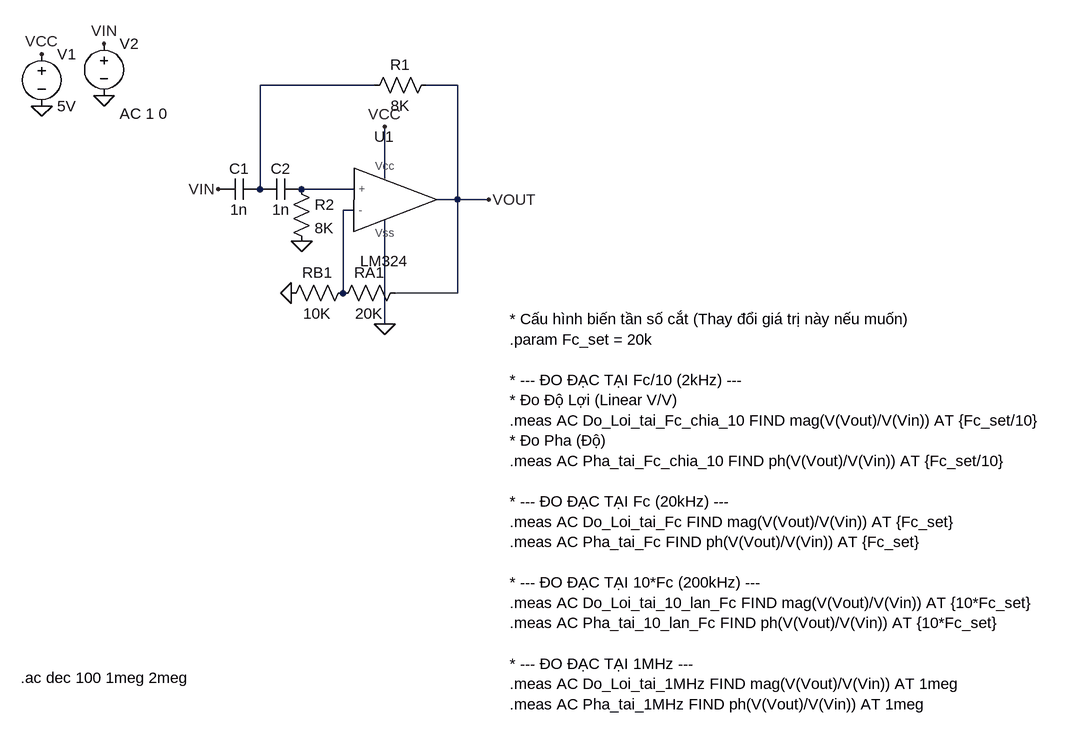
[diagram p0: schematic BAI 4 THUC HANH 3.asc]
BAI 4 THUC HANH 3.asc, the LTspice schematic file:
Version 4.1
SHEET 1 1424 1044
WIRE 320 -32 144 -32
WIRE 448 -32 400 -32
WIRE 336 112 336 32
WIRE 144 128 144 -32
WIRE 288 128 208 128
WIRE 448 144 448 -32
WIRE 448 144 416 144
WIRE 496 144 448 144
WIRE 288 160 272 160
WIRE 272 288 272 160
WIRE 448 288 448 144
WIRE 448 288 352 288
WIRE 336 336 336 176
FLAG 496 144 VOUT
FLAG 208 208 0
FLAG 192 288 0
FLAG 80 128 VIN
FLAG 336 32 VCC
FLAG -96 -16 0
FLAG -192 0 0
FLAG -192 -80 VCC
FLAG -96 -96 VIN
FLAG 336 336 0
SYMBOL LM324 336 144 R0
SYMATTR InstName U1
SYMBOL res 416 -48 R90
WINDOW 0 0 56 VBottom 2
WINDOW 3 32 56 VTop 2
SYMATTR InstName R1
SYMATTR Value 8K
SYMBOL cap 144 112 R90
WINDOW 0 0 32 VBottom 2
WINDOW 3 32 32 VTop 2
SYMATTR InstName C1
SYMATTR Value 1n
SYMBOL cap 208 112 R90
WINDOW 0 0 32 VBottom 2
WINDOW 3 32 32 VTop 2
SYMATTR InstName C2
SYMATTR Value 1n
SYMBOL res 192 112 R0
SYMATTR InstName R2
SYMATTR Value 8K
SYMBOL res 368 272 R90
WINDOW 0 0 56 VBottom 2
WINDOW 3 32 56 VTop 2
SYMATTR InstName RA1
SYMATTR Value 20K
SYMBOL res 288 272 R90
WINDOW 0 0 56 VBottom 2
WINDOW 3 32 56 VTop 2
SYMATTR InstName RB1
SYMATTR Value 10K
SYMBOL voltage -192 -96 R0
SYMATTR InstName V1
SYMATTR Value 5V
SYMBOL voltage -96 -112 R0
WINDOW 123 24 124 Left 2
WINDOW 39 0 0 Left 0
SYMATTR Value2 AC 1 0
SYMATTR InstName V2
SYMATTR Value ""
TEXT 528 328 Left 2 !* Cấu hình biến tần số cắt (Thay đổi giá trị này nếu muốn)\n.param Fc_set = 20k\n \n* --- ĐO ĐẠC TẠI Fc/10 (2kHz) ---\n* Đo Độ Lợi (Linear V/V)\n.meas AC Do_Loi_tai_Fc_chia_10 FIND mag(V(Vout)/V(Vin)) AT {Fc_set/10}\n* Đo Pha (Độ)\n.meas AC Pha_tai_Fc_chia_10 FIND ph(V(Vout)/V(Vin)) AT {Fc_set/10}\n \n* --- ĐO ĐẠC TẠI Fc (20kHz) ---\n.meas AC Do_Loi_tai_Fc FIND mag(V(Vout)/V(Vin)) AT {Fc_set}\n.meas AC Pha_tai_Fc FIND ph(V(Vout)/V(Vin)) AT {Fc_set}\n \n* --- ĐO ĐẠC TẠI 10*Fc (200kHz) ---\n.meas AC Do_Loi_tai_10_lan_Fc FIND mag(V(Vout)/V(Vin)) AT {10*Fc_set}\n.meas AC Pha_tai_10_lan_Fc FIND ph(V(Vout)/V(Vin)) AT {10*Fc_set}\n \n* --- ĐO ĐẠC TẠI 1MHz ---\n.meas AC Do_Loi_tai_1MHz FIND mag(V(Vout)/V(Vin)) AT 1meg\n.meas AC Pha_tai_1MHz FIND ph(V(Vout)/V(Vin)) AT 1meg
TEXT -224 880 Left 2 !.ac dec 100 1meg 2meg

The netlist it stands for:
* BAI 4 THUC HANH 3.asc
X§U1 N002 N003 VCC 0 VOUT LM324  ; pins + - Vcc Vss ?
R1 VOUT N001 8K
C1 N001 VIN 1n
C2 N002 N001 1n
R2 N002 0 8K
RA1 VOUT N003 20K
RB1 N003 0 10K
V1 VCC 0 5V
V2 VIN 0 AC 1 0
* Cấu hình biến tần số cắt (Thay đổi giá trị này nếu muốn)
.param Fc_set = 20k
* --- ĐO ĐẠC TẠI Fc/10 (2kHz) ---
* Đo Độ Lợi (Linear V/V)
.meas AC Do_Loi_tai_Fc_chia_10 FIND mag(V(Vout)/V(Vin)) AT {Fc_set/10}
* Đo Pha (Độ)
.meas AC Pha_tai_Fc_chia_10 FIND ph(V(Vout)/V(Vin)) AT {Fc_set/10}
* --- ĐO ĐẠC TẠI Fc (20kHz) ---
.meas AC Do_Loi_tai_Fc FIND mag(V(Vout)/V(Vin)) AT {Fc_set}
.meas AC Pha_tai_Fc FIND ph(V(Vout)/V(Vin)) AT {Fc_set}
* --- ĐO ĐẠC TẠI 10*Fc (200kHz) ---
.meas AC Do_Loi_tai_10_lan_Fc FIND mag(V(Vout)/V(Vin)) AT {10*Fc_set}
.meas AC Pha_tai_10_lan_Fc FIND ph(V(Vout)/V(Vin)) AT {10*Fc_set}
* --- ĐO ĐẠC TẠI 1MHz ---
.meas AC Do_Loi_tai_1MHz FIND mag(V(Vout)/V(Vin)) AT 1meg
.meas AC Pha_tai_1MHz FIND ph(V(Vout)/V(Vin)) AT 1meg
.ac dec 100 1meg 2meg
.lib E:\ThiThucHanhCoHa\CoHa\LM324.cir
.backanno
.end